# EAGLE design pcbmotor (EAGLE 9.3.2)
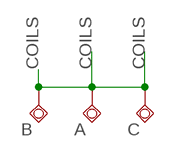
[diagram p0: schematic, sheet 1]

## Parts
A  TESTPAD_TPSQPAD1-20Y  [TESTPAD_P1-20Y]
B  TESTPAD_TPSQPAD1-20Y  [TESTPAD_P1-20Y]
C  TESTPAD_TPSQPAD1-20Y  [TESTPAD_P1-20Y]

## Nets
COILS: A.TP B.TP C.TP

## Library data of the parts
A B C = BeagleBone_Blue_R3:TESTPAD_TPSQ: Test pad

## Board
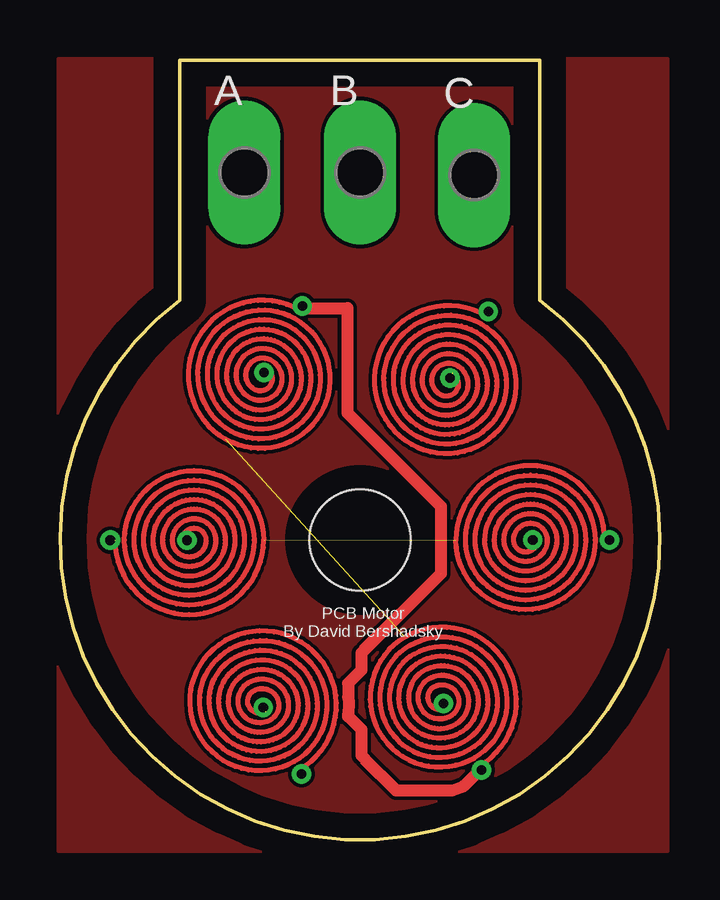
[diagram p1: board, top side]
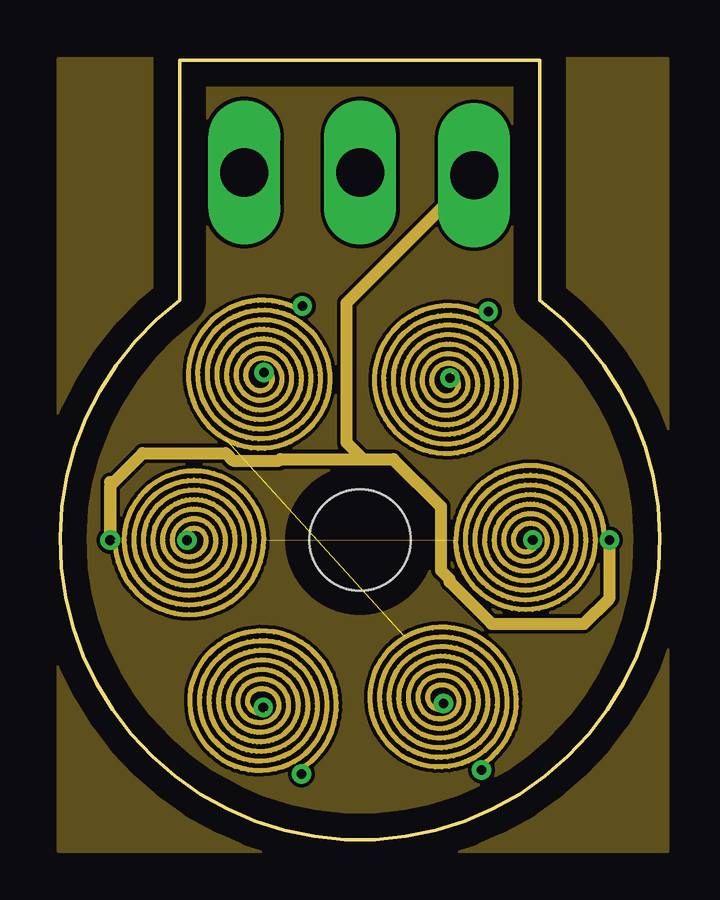
[diagram p2: board, inner layer Route2]
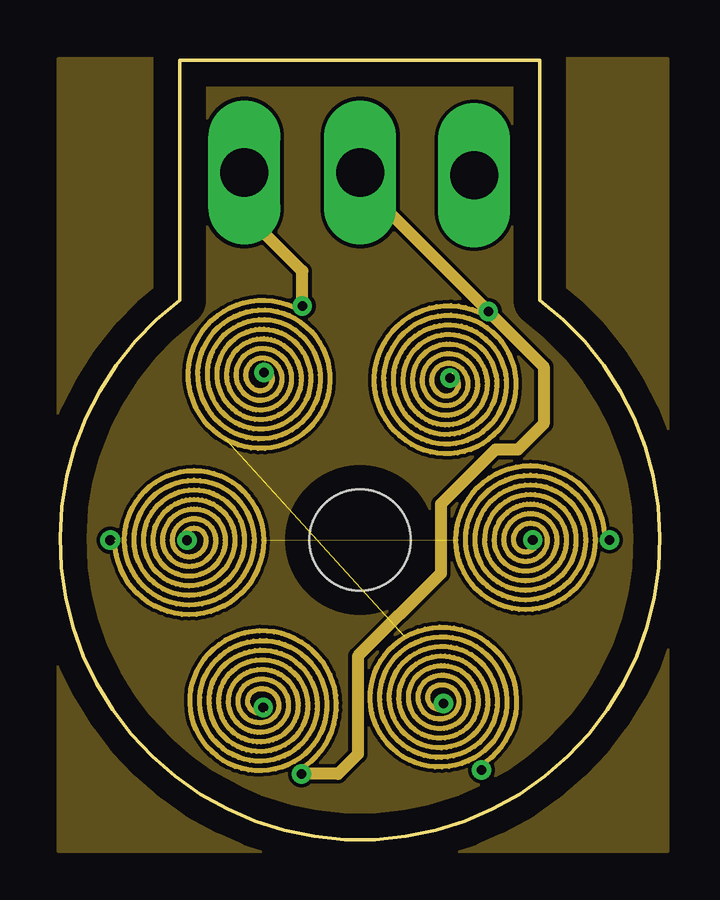
[diagram p3: board, inner layer Route15]
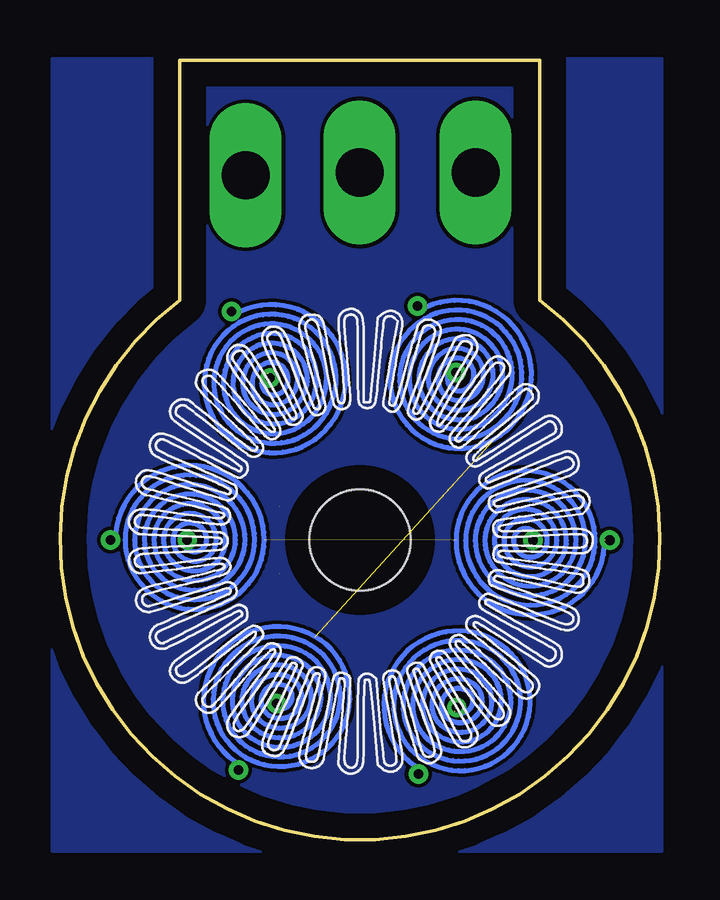
[diagram p4: board, bottom side, seen from below]

Size 25 x 32.48 mm. Coordinates in mm from the lower left corner, seen from the top.
Outline: 20,32.48 5,32.48 5,22.48 arc286 20,22.48 20,32.48
Copper layers (1+2*15+16): Top 0.035mm / dielectric 1.5mm / Route2 0.035mm / dielectric 0.15mm / Route15 0.035mm / dielectric 0.2mm / Bottom 0.035mm
Design rules "default *": minimum track width 6mil, minimum drill 0.35mm, track to track 6mil, track to pad 6mil, pad to pad 6mil, via to via 6mil, smd to smd 6mil, copper to edge 40mil, drill to drill 6mil, minimum pad ring 10mil, minimum via ring 8mil, stop-mask expansion 4mil, vias tented up to drill 0mil, thermal gap 10mil
Holes 4.2 mm at 12.5,12.48

### Footprints (pad centres in the part's own frame; a part is rotated, then mirrored left to right if it is on the bottom)
TESTPAD_P1-20Y = drill 2.007 pad 2.54 long: TP 0,0

### Placement (x,y rotation side)
A  7.68,27.79 0 top
B  12.51,27.79 0 top
C  17.26,27.68 0 top

### Tracks (layer width: path | path; a pad name or v marks a point on that pad's centre or on a via)
A  (1 unrouted)
  Bottom 0.2: 16.07,5.52 arc-180 15.57,6.38 arc-180 16.27,5.17 arc-180 15.37,6.73 arc-180 16.47,4.82 arc-180 15.17,7.08 arc-180 16.67,4.48 arc-180 14.97,7.42 arc-180 16.87,4.13 arc-180 14.77,7.77 arc-180 17.07,3.78 arc-180 14.57,8.11 arc-180 17.27,3.44 arc-180 14.37,8.46 arc-180 17.47,3.09 | 8.6,19.63 arc-180 8.1,18.76 arc-180 8.8,19.97 arc-180 7.9,18.41 arc-180 9,20.32 arc-180 7.7,18.07 arc-180 9.2,20.67 arc-180 7.5,17.72 arc-180 9.4,21.01 arc-180 7.3,17.38 arc-180 9.6,21.36 arc-180 7.1,17.03 arc-180 9.8,21.71 arc-180 6.9,16.68 arc-180 10,22.05
C  (via drill 0.4 pad 0.6)  (2 unrouted)
  Top 0.2: 5.09,12.47 arc-180 6.09,12.47 arc-180 4.69,12.47 arc-180 6.49,12.47 arc-180 4.29,12.47 arc-180 6.89,12.47 arc-180 3.89,12.47 arc-180 7.29,12.47 arc-180 3.49,12.47 arc-180 7.69,12.47 arc-180 3.09,12.47 arc-180 8.09,12.47 arc-180 2.69,12.47 arc-180 8.49,12.47 arc-180 2.29,12.47
  Top 0.203: v5.29,12.47 5.09,12.47 | v2.09,12.47 2.29,12.47
  Route2 0.2: 5.09,12.47 arc-180 6.09,12.47 arc-180 4.69,12.47 arc-180 6.49,12.47 arc-180 4.29,12.47 arc-180 6.89,12.47 arc-180 3.89,12.47 arc-180 7.29,12.47 arc-180 3.49,12.47 arc-180 7.69,12.47 arc-180 3.09,12.47 arc-180 8.09,12.47 arc-180 2.69,12.47 arc-180 8.49,12.47 arc-180 2.29,12.47
  Route2 0.203: 2.2,12.47 2.29,12.47 | v5.29,12.47 5.09,12.47
  Route2 0.508: 2.09,14.89 2.09,12.58 2.2,12.47
  Bottom 0.2: 19.89,12.49 arc-180 18.89,12.49 arc-180 20.29,12.49 arc-180 18.49,12.49 arc-180 20.69,12.49 arc-180 18.09,12.49 arc-180 21.09,12.49 arc-180 17.69,12.49 arc-180 21.49,12.49 arc-180 17.29,12.49 arc-180 21.89,12.49 arc-180 16.89,12.49 arc-180 22.29,12.49 arc-180 16.49,12.49 arc-180 22.69,12.49 | 5.1,12.46 arc-180 6.1,12.46 arc-180 4.7,12.46 arc-180 6.5,12.46 arc-180 4.3,12.46 arc-180 6.9,12.46 arc-180 3.9,12.46 arc-180 7.3,12.46 arc-180 3.5,12.46 arc-180 7.7,12.46 arc-180 3.1,12.46 arc-180 8.1,12.46 arc-180 2.7,12.46 arc-180 8.5,12.46 arc-180 2.3,12.46
COILS  (via drill 0.4 pad 0.6)  (5 unrouted)
  Top 0.152: 2.31,12.48 2.3,12.48 v2.1,12.48
  Top 0.2: 8.57,5.33 arc-180 8.07,6.2 arc-180 8.77,4.99 arc-180 7.87,6.55 arc-180 8.97,4.64 arc-180 7.67,6.89 arc-180 9.17,4.3 arc-180 7.47,7.24 arc-180 9.37,3.95 arc-180 7.27,7.59 arc-180 9.57,3.6 arc-180 7.07,7.93 arc-180 9.77,3.26 arc-180 6.87,8.28 arc-180 9.97,2.91 | 16.35,19.41 arc-180 15.85,18.54 arc-180 16.55,19.76 arc-180 15.65,18.2 arc-180 16.75,20.1 arc-180 15.45,17.85 arc-180 16.95,20.45 arc-180 15.25,17.5 arc-180 17.15,20.8 arc-180 15.05,17.16 arc-180 17.35,21.14 arc-180 14.85,16.81 arc-180 17.55,21.49 arc-180 14.65,16.47 arc-180 17.75,21.83 | 8.6,19.63 arc-180 8.1,18.76 arc-180 8.8,19.98 arc-180 7.9,18.42 arc-180 9,20.32 arc-180 7.7,18.07 arc-180 9.2,20.67 arc-180 7.5,17.72 arc-180 9.4,21.02 arc-180 7.3,17.38 arc-180 9.6,21.36 arc-180 7.1,17.03 arc-180 9.8,21.71 arc-180 6.9,16.69 arc-180 10,22.06 | 16.07,5.49 arc-180 15.57,6.36 arc-180 16.27,5.15 arc-180 15.37,6.7 arc-180 16.47,4.8 arc-180 15.17,7.05 arc-180 16.67,4.45 arc-180 14.97,7.4 arc-180 16.87,4.11 arc-180 14.77,7.74 arc-180 17.07,3.76 arc-180 14.57,8.09 arc-180 17.27,3.41 arc-180 14.37,8.44 arc-180 17.47,3.07 | 19.9,12.48 arc-180 18.9,12.48 arc-180 20.3,12.48 arc-180 18.5,12.48 arc-180 20.7,12.48 arc-180 18.1,12.48 arc-180 21.1,12.48 arc-180 17.7,12.48 arc-180 21.5,12.48 arc-180 17.3,12.48 arc-180 21.9,12.48 arc-180 16.9,12.48 arc-180 22.3,12.48 arc-180 16.5,12.48 arc-180 22.7,12.48
  Top 0.203: v10.07,2.74 10.07,2.81 9.97,2.91 | v8.47,5.51 8.47,5.43 8.57,5.33 | v16.25,19.24 16.35,19.34 16.35,19.41 | v17.85,22.01 17.75,21.91 17.75,21.83 | 12.55,3.5 12.68,3.37 | 14.07,9.5 12.55,7.99 12.55,7.13 | 17.57,2.97 17.47,3.07 | v15.97,5.66 15.97,5.59 16.07,5.49 | v8.5,19.46 8.5,19.53 8.6,19.63 | v10.1,22.23 10.1,22.16 10,22.06 | v19.7,12.48 19.9,12.48 | v22.9,12.48 22.7,12.48
  Top 0.508: v10.1,22.23 10.18,22.14 11.97,22.14 11.97,17.78 15.87,13.88 15.87,11.09 12.55,7.77 12.55,7.13 12.55,7.06 12.01,6.51 12.01,5.94 12.04,5.69 12.01,5.21 12.01,5.14 12.55,4.59 12.55,3.5 | 12.68,3.37 14,2.05 16.33,2.05 16.82,2.23 17.57,2.97
  Route2 0.2: 8.57,5.33 arc-180 8.07,6.2 arc-180 8.77,4.99 arc-180 7.87,6.55 arc-180 8.97,4.64 arc-180 7.67,6.89 arc-180 9.17,4.3 arc-180 7.47,7.24 arc-180 9.37,3.95 arc-180 7.27,7.59 arc-180 9.57,3.6 arc-180 7.07,7.93 arc-180 9.77,3.26 arc-180 6.87,8.28 arc-180 9.97,2.91 | 16.35,19.41 arc-180 15.85,18.54 arc-180 16.55,19.76 arc-180 15.65,18.2 arc-180 16.75,20.1 arc-180 15.45,17.85 arc-180 16.95,20.45 arc-180 15.25,17.5 arc-180 17.15,20.8 arc-180 15.05,17.16 arc-180 17.35,21.14 arc-180 14.85,16.81 arc-180 17.55,21.49 arc-180 14.65,16.47 arc-180 17.75,21.83 | 8.6,19.63 arc-180 8.1,18.76 arc-180 8.8,19.98 arc-180 7.9,18.42 arc-180 9,20.32 arc-180 7.7,18.07 arc-180 9.2,20.67 arc-180 7.5,17.72 arc-180 9.4,21.02 arc-180 7.3,17.38 arc-180 9.6,21.36 arc-180 7.1,17.03 arc-180 9.8,21.71 arc-180 6.9,16.69 arc-180 10,22.06 | 16.07,5.49 arc-180 15.57,6.36 arc-180 16.27,5.15 arc-180 15.37,6.7 arc-180 16.47,4.8 arc-180 15.17,7.05 arc-180 16.67,4.45 arc-180 14.97,7.4 arc-180 16.87,4.11 arc-180 14.77,7.74 arc-180 17.07,3.76 arc-180 14.57,8.09 arc-180 17.27,3.41 arc-180 14.37,8.44 arc-180 17.47,3.07 | 19.9,12.48 arc-180 18.9,12.48 arc-180 20.3,12.48 arc-180 18.5,12.48 arc-180 20.7,12.48 arc-180 18.1,12.48 arc-180 21.1,12.48 arc-180 17.7,12.48 arc-180 21.5,12.48 arc-180 17.3,12.48 arc-180 21.9,12.48 arc-180 16.9,12.48 arc-180 22.3,12.48 arc-180 16.5,12.48 arc-180 22.7,12.48
  Route2 0.203: v8.47,5.51 8.57,5.41 8.57,5.33 | v10.07,2.74 9.97,2.84 9.97,2.91 | v17.85,22.01 17.75,21.91 17.75,21.83 | v16.25,19.24 16.35,19.34 16.35,19.41 | v15.97,5.66 16.07,5.56 16.07,5.49 | v17.57,2.91 17.47,3 17.47,3.07 | v8.5,19.46 8.6,19.56 8.6,19.63 | v10.1,22.23 10,22.13 10,22.06 | 12.63,15.7 13.83,15.7 15.75,13.78 15.75,11.22 16.24,10.74 | 22.79,12.48 22.7,12.48 | v19.7,12.48 19.9,12.48
  Route2 0.508: v2.1,12.48 2.1,14.75 3.45,16.1 6.9,16.1 7.21,15.79 9.13,15.79 9.19,15.85 12.63,15.85 | 12.63,15.85 13.9,15.85 15.87,13.88 15.87,11.22 16.24,10.86 16.24,10.74 17.99,8.99 21.82,8.99 22.9,10.06 22.9,12.37 22.79,12.48 | 12.63,15.85 11.94,16.54 11.94,22.37 C.TP
  Route15 0.2: 16.35,19.41 arc-180 15.85,18.54 arc-180 16.55,19.76 arc-180 15.65,18.2 arc-180 16.75,20.1 arc-180 15.45,17.85 arc-180 16.95,20.45 arc-180 15.25,17.5 arc-180 17.15,20.8 arc-180 15.05,17.16 arc-180 17.35,21.14 arc-180 14.85,16.81 arc-180 17.55,21.49 arc-180 14.65,16.47 arc-180 17.75,21.83 | v10.07,2.74 9.97,2.84 9.97,2.91 arc180 6.87,8.28 arc180 9.77,3.26 arc180 7.07,7.93 arc180 9.57,3.6 arc180 7.27,7.59 arc180 9.37,3.95 arc180 7.47,7.24 arc180 9.17,4.3 arc180 7.67,6.89 arc180 8.97,4.64 arc180 7.87,6.55 arc180 8.77,4.99 arc180 8.07,6.2 arc180 8.57,5.33 8.57,5.41 v8.47,5.51
  Route15 0.508: B.TP 12.51,27.35 v17.85,22.01 20.15,19.71 20.15,17.32 19.08,16.25 18.14,16.25 15.87,13.98 15.87,11.09 12.42,7.63 12.42,3.56 11.59,2.74 v10.07,2.74 | v10.1,22.23 10.1,23.69 7.68,26.1 A.TP
  Bottom 0.2: 8.55,5.34 arc-180 8.05,6.2 arc-180 8.75,4.99 arc-180 7.85,6.55 arc-180 8.95,4.65 arc-180 7.65,6.9 arc-180 9.15,4.3 arc-180 7.45,7.24 arc-180 9.35,3.95 arc-180 7.25,7.59 arc-180 9.55,3.61 arc-180 7.05,7.94 arc-180 9.75,3.26 arc-180 6.85,8.28 arc-180 9.95,2.91 | 16.34,19.45 arc-180 15.84,18.58 arc-180 16.54,19.8 arc-180 15.64,18.24 arc-180 16.74,20.14 arc-180 15.44,17.89 arc-180 16.94,20.49 arc-180 15.24,17.54 arc-180 17.14,20.83 arc-180 15.04,17.2 arc-180 17.34,21.18 arc-180 14.84,16.85 arc-180 17.54,21.53 arc-180 14.64,16.5 arc-180 17.74,21.87
GND
  pour Bottom: -0.07,-0.49 25.33,-0.49 25.33,32.53 -0.07,32.53
  pour Route15: -0.07,-0.49 25.33,-0.49 25.33,32.53 -0.07,32.53
  pour Route2: -0.07,-0.49 25.33,-0.49 25.33,32.53 -0.07,32.53
  pour Top: -0.07,-0.49 25.33,-0.49 25.33,32.53 -0.07,32.53
N$1
  Route15 0.2: 5.09,12.47 arc-180 6.09,12.47 arc-180 4.69,12.47 arc-180 6.49,12.47 arc-180 4.29,12.47 arc-180 6.89,12.47 arc-180 3.89,12.47 arc-180 7.29,12.47 arc-180 3.49,12.47 arc-180 7.69,12.47 arc-180 3.09,12.47 arc-180 8.09,12.47 arc-180 2.69,12.47 arc-180 8.49,12.47 arc-180 2.29,12.47
N$2
  Route15 0.2: 19.9,12.48 arc-180 18.9,12.48 arc-180 20.3,12.48 arc-180 18.5,12.48 arc-180 20.7,12.48 arc-180 18.1,12.48 arc-180 21.1,12.48 arc-180 17.7,12.48 arc-180 21.5,12.48 arc-180 17.3,12.48 arc-180 21.9,12.48 arc-180 16.9,12.48 arc-180 22.3,12.48 arc-180 16.5,12.48 arc-180 22.7,12.48
N$4
  Route15 0.2: 8.6,19.63 arc-180 8.1,18.76 arc-180 8.8,19.98 arc-180 7.9,18.42 arc-180 9,20.32 arc-180 7.7,18.07 arc-180 9.2,20.67 arc-180 7.5,17.72 arc-180 9.4,21.02 arc-180 7.3,17.38 arc-180 9.6,21.36 arc-180 7.1,17.03 arc-180 9.8,21.71 arc-180 6.9,16.69 arc-180 10,22.06
N$5
  Route15 0.2: 16.07,5.49 arc-180 15.57,6.36 arc-180 16.27,5.15 arc-180 15.37,6.7 arc-180 16.47,4.8 arc-180 15.17,7.05 arc-180 16.67,4.45 arc-180 14.97,7.4 arc-180 16.87,4.11 arc-180 14.77,7.74 arc-180 17.07,3.76 arc-180 14.57,8.09 arc-180 17.27,3.41 arc-180 14.37,8.44 arc-180 17.47,3.07

### Text on the board
tNames: PCB Motor / By David Bershadsky